# Altium project All-in-One.PrjPcb
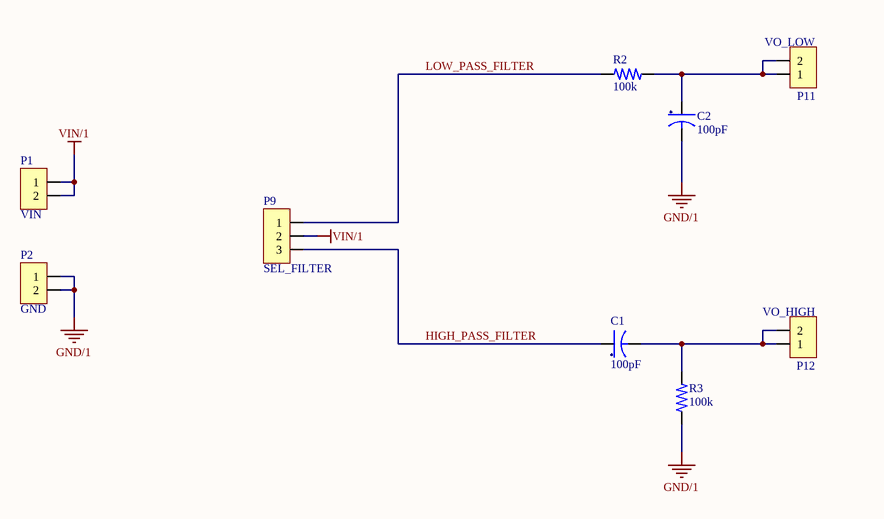
[diagram p0: Experiment 1.SchDoc]
3 sheets, 48 parts. Net scope: global (net labels, ports and power ports of the same name join across sheets).
Board file: All-in-One.PcbDoc
Sheets:
  Experiment 1.SchDoc
  Experiment 2.SchDoc
  Experiment 3.SchDoc

## Sheet Experiment 1.SchDoc
size A4; Organization: Altium Limited; Address1: L3, 12a Rodborough Rd; Address2: Frenchs Forest; Address3: NSW; Address4: Australia 2086; DocumentNumber: 1; SheetNumber: 1; SheetTotal: 3

### Parts
C1  100pF  [C0805]
C2  100pF  [C0805]
P1  VIN  [PINHD-1X02 ONCE]  (net tie, no BOM)
P2  GND  [PINHD-1X02 ONCE]  (net tie, no BOM)
P9  SEL_FILTER  [PINHD-1X03]
P11  VO_LOW  [PINHD-1X02 ONCE]  (net tie, no BOM)
P12  VO_HIGH  [PINHD-1X02 ONCE]  (net tie, no BOM)
R2  100k  [R0805]
R3  100k  [R0805]

### Nets
GND/1: C2.2 P2.1 P2.2 R3.1
VIN/1: P1.1 P1.2 P9.2
HIGH_PASS_FILTER: C1.1 P9.3
LOW_PASS_FILTER: P9.1 R2.1
NetC1_2: C1.2 P12.1 P12.2 R3.2
NetC2_1: C2.1 P11.1 P11.2 R2.2

### Notes on the sheet
- Elivelton Santos
- https://github.com/eliveltonpsantos
- Project:
- Sheet:
- Date:
- Time:
- Sheet
- of
- File:

### Library data of the parts
C1 C2 = CC0805JRNPO9BN101: CAP CER 100PF 50V NPO 0805; Manufacturer: Yageo; Tolerance: ±5%; Category: Capacitors; Manufacturer Part Number: CC0805JRNPO9BN101; Package / Case: 0805 (2012 Metric); Capacitance: 100pF; Voltage: 50V; Supplier 1: Digi-Key; Supplier Part Number 1: 311-1111-1-ND
P1 P2 P11 P12 = PIN HEADER 1X02 ONCE: CONN HEADER 2POS .100" STR TIN; Manufacturer: Molex, LLC; Manufacturer Part Number: 0901200122; Category: Connectors; Supplier 1: Digi-Key; Supplier Part Number 1: WM8072-ND
P9 = PIN HEADER 1X03: CONN HEADER 3POS .100" STR TIN; Manufacturer: Molex, LLC; Manufacturer Part Number: 0901200123; Category: Connectors; Supplier 1: Digi-Key; Supplier Part Number 1: WM8073-ND
R2 R3 = ERJ-6ENF1003V: RES SMD 100K OHM 1% 1/8W 0805; Manufacturer: Panasonic Electronic Components; Power (Watts): 0.125W, 1/8W; Category: Resistors; Manufacturer Part Number: ERJ-6ENF1003V; Package / Case: 0805 (2012 Metric); Resistance (Ohms): 100k; Tolerance: ±1%; Supplier 1: Digi-Key; Supplier Part Number 1: P100KCCT-ND

## Sheet Experiment 2.SchDoc
size A4; Organization: Altium Limited; Address1: L3, 12a Rodborough Rd; Address2: Frenchs Forest; Address3: NSW; Address4: Australia 2086; DocumentNumber: 2; SheetNumber: 2; SheetTotal: 3
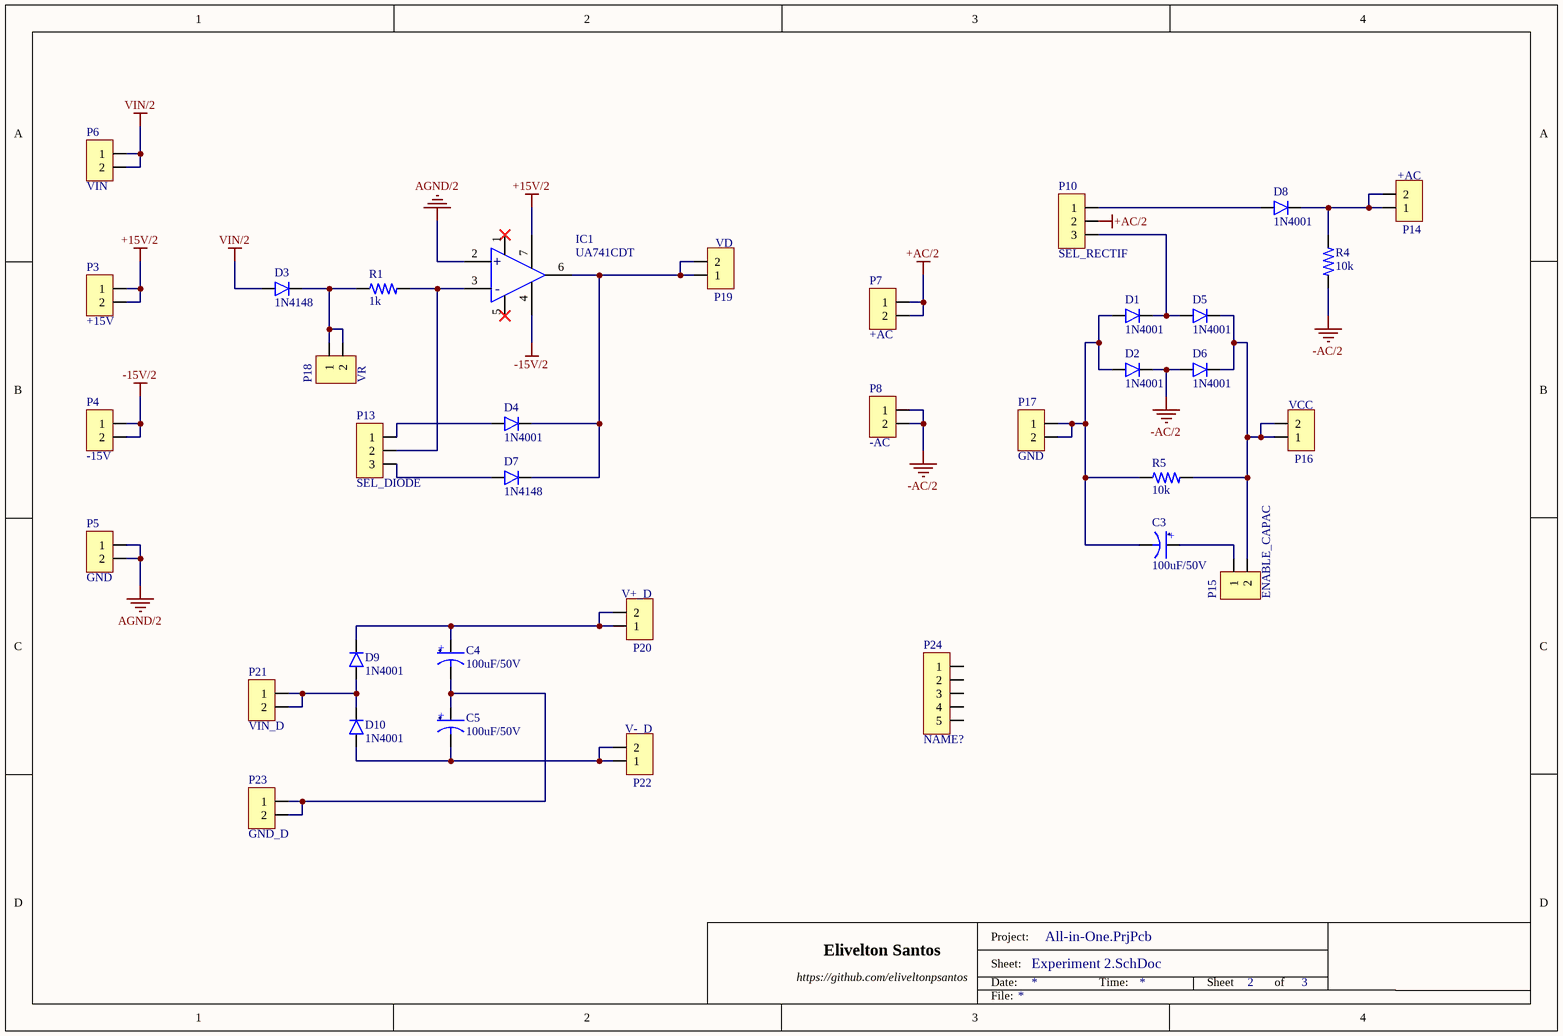
[diagram p1: Experiment 2.SchDoc]

### Parts
C3  100uF/50V  [C-3.5x8]
C4  100uF/50V  [C-3.5x8]
C5  100uF/50V  [C-3.5x8]
D1  1N4001  [DO41-10]
D2  1N4001  [DO41-10]
D3  1N4148  [DO35-10]
D4  1N4001  [DO41-10]
D5  1N4001  [DO41-10]
D6  1N4001  [DO41-10]
D7  1N4148  [DO35-10]
D8  1N4001  [DO41-10]
D9  1N4001  [DO41-10]
D10  1N4001  [DO41-10]
IC1  UA741CDT  [SOIC-8]
P3  +15V  [PINHD-1X02 ONCE]  (net tie, no BOM)
P4  -15V  [PINHD-1X02 ONCE]  (net tie, no BOM)
P5  GND  [PINHD-1X02 ONCE]  (net tie, no BOM)
P6  VIN  [PINHD-1X02 ONCE]  (net tie, no BOM)
P7  +AC  [PINHD-1X02 ONCE]  (net tie, no BOM)
P8  -AC  [PINHD-1X02 ONCE]  (net tie, no BOM)
P10  SEL_RECTIF  [PINHD-1X03]
P13  SEL_DIODE  [PINHD-1X03]
P14  +AC  [PINHD-1X02 ONCE]  (net tie, no BOM)
P15  ENABLE_CAPAC  [PINHD-1X02]
P16  VCC  [PINHD-1X02 ONCE]  (net tie, no BOM)
P17  GND  [PINHD-1X02 ONCE]  (net tie, no BOM)
P18  VR  [PINHD-1X02 ONCE]  (net tie, no BOM)
P19  VD  [PINHD-1X02 ONCE]  (net tie, no BOM)
P20  V+_D  [PINHD-1X02 ONCE]
P21  VIN_D  [PINHD-1X02 ONCE]
P22  V-_D  [PINHD-1X02 ONCE]
P23  GND_D  [PINHD-1X02 ONCE]
P24  NAME?  [PINHD-1X05]
R1  1k  [R0805]
R4  10k  [R0805]
R5  10k  [R0805]

### Nets
+15V/2: IC1.7(VCC+) P3.1 P3.2
+AC/2: P7.1 P7.2 P10.2
-15V/2: IC1.4(VCC-) P4.1 P4.2
-AC/2: D2.C(Cathode) D6.A(Anode) P8.1 P8.2 R4.1
AGND/2: IC1.2(-) P5.1 P5.2
VIN/2: D3.A(Anode) P6.1 P6.2
NetC3_1: C3.1(+) P15.1
NetC3_2: C3.2(-) D1.A(Anode) D2.A(Anode) P17.1 P17.2 R5.1
NetC4_1: C4.1(+) D9.C(Cathode) P20.1 P20.2
NetC4_2: C4.2(-) C5.1(+) P23.1 P23.2
NetC5_2: C5.2(-) D10.A(Anode) P22.1 P22.2
NetD1_C: D1.C(Cathode) D5.A(Anode) P10.3
NetD3_C: D3.C(Cathode) P18.1 P18.2 R1.1
NetD4_A: D4.A(Anode) P13.1
NetD4_C: D4.C(Cathode) D7.C(Cathode) IC1.6(OUTPUT) P19.1 P19.2
NetD5_C: D5.C(Cathode) D6.C(Cathode) P15.2 P16.1 P16.2 R5.2
NetD7_A: D7.A(Anode) P13.3
NetD8_A: D8.A(Anode) P10.1
NetD8_C: D8.C(Cathode) P14.1 P14.2 R4.2
NetD9_A: D9.A(Anode) D10.C(Cathode) P21.1 P21.2
NetIC1_3: IC1.3(+) P13.2 R1.2

Not connected (* = marked no-connect by the designer): IC1 1(OFFSET1)* 5(OFFSET2)*; P24 1 2 3 4 5

### Notes on the sheet
- Elivelton Santos
- https://github.com/eliveltonpsantos
- Project:
- Sheet:
- Date:
- Time:
- Sheet
- of
- File:

### Library data of the parts
C3-C5 = UVR1H101MPD: CAP ALUM 100UF 20% 50V RADIAL; Manufacturer: Nichicon; Category: Capacitors; Manufacturer Part Number: UVR1H101MPD; Package / Case: C-3.5x8; Capacitance: 100uF; Tolerance: ±20%; Supplier 1: Digi-Key; Supplier Part Number 1: 493-1107-ND; Voltage: 50V
D1 D2 D4-D6 D8-D10 = 1N4001: DIODE GEN PURP 50V 1A DO41; Manufacturer: Fairchild Semiconductor; Category: Diodes; Manufacturer Part Number: 1N4001; Package / Case: DO-41; Reverse Voltage: 50V; Forward Current: 1A; Supplier 1: Digi-Key; Supplier Part Number 1: 1N4001FSCT-ND
D3 D7 = 1N4148: DIODE GEN PURP 100V 200MA DO35; Manufacturer: Fairchild Semiconductor; Category: Diodes; Manufacturer Part Number: 1N4148; Package / Case: DO-35; Reverse Voltage: 100V; Forward Current: 200mA; Supplier 1: Digi-Key; Supplier Part Number 1: 1N4148FS-ND
IC1 = UA741CDT: IC OPAMP GP 1MHZ 8SO; Manufacturer: STMicroelectronics; Category: ICs; Manufacturer Part Number: UA741CDT; Package / Case: 8-SOIC; Supplier 1: Digi-Key; Supplier Part Number 1: 497-3075-1-ND
P3-P8 P14 P16-P23 = PIN HEADER 1X02 ONCE: as P1 on sheet Experiment 1; Category: Connectors; Supplier 1: Digi-Key; Supplier Part Number 1: WM8072-ND
P10 P13 = PIN HEADER 1X03: as P9 on sheet Experiment 1; Category: Connectors; Supplier 1: Digi-Key; Supplier Part Number 1: WM8073-ND
P15 = PIN HEADER 1X02: CONN HEADER 2POS .100" STR TIN; Manufacturer: Molex, LLC; Manufacturer Part Number: 0901200122; Category: Connectors; Supplier 1: Digi-Key; Supplier Part Number 1: WM8072-ND
P24 = PIN HEADER 1X05: CONN HEADER 5POS .100" STR TIN; Manufacturer: Molex, LLC; Manufacturer Part Number: 0901200125; Category: Connectors; Supplier 1: Digi-Key; Supplier Part Number 1: WM8075-ND
R1 = ERJ-6ENF1001V: RES SMD 1K OHM 1% 1/8W 0805; Manufacturer: Panasonic Electronic Components; Power (Watts): 0.125W, 1/8W; Category: Resistors; Manufacturer Part Number: ERJ-6ENF1001V; Package / Case: 0805 (2012 Metric); Resistance (Ohms): 1k; Tolerance: ±1%; Supplier 1: Digi-Key; Supplier Part Number 1: P1.00KCCT-ND
R4 R5 = ERJ-6ENF1002V: RES SMD 10K OHM 1% 1/8W 0805; Manufacturer: Panasonic Electronic Components; Power (Watts): 0.125W, 1/8W; Category: Resistors; Manufacturer Part Number: ERJ-6ENF1002V; Package / Case: 0805 (2012 Metric); Resistance (Ohms): 10k; Tolerance: ±1%; Supplier 1: Digi-Key; Supplier Part Number 1: P10.0KCCT-ND

## Sheet Experiment 3.SchDoc
size A4; Organization: Altium Limited; Address1: L3, 12a Rodborough Rd; Address2: Frenchs Forest; Address3: NSW; Address4: Australia 2086; DocumentNumber: 3; SheetNumber: 3; SheetTotal: 3
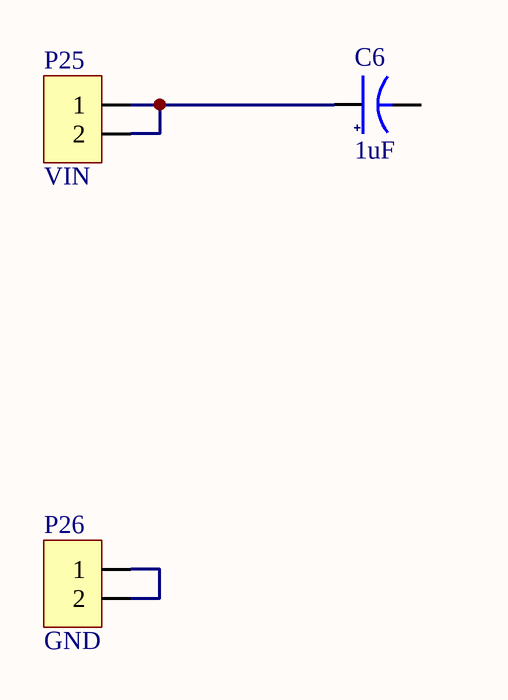
[diagram p2: Experiment 3.SchDoc]

### Parts
C6  1uF  [C0805]
P25  VIN  [PINHD-1X02 ONCE]
P26  GND  [PINHD-1X02 ONCE]

### Nets
NetC6_1: C6.1 P25.1 P25.2
NetP26_1: P26.1 P26.2

Not connected (* = marked no-connect by the designer): C6 2

### Notes on the sheet
- Elivelton Santos
- https://github.com/eliveltonpsantos
- Project:
- Sheet:
- Date:
- Time:
- Sheet
- of
- File:

### Library data of the parts
C6 = CC0805ZKY5V9BB105: CAP CER 1UF 50V Y5V 0805; Manufacturer: Yageo; Tolerance: ±20%; Category: Capacitors; Manufacturer Part Number: CC0805ZKY5V9BB105; Package / Case: 0805 (2012 Metric); Capacitance: 1uF; Voltage: 50V; Supplier 1: Digi-Key; Supplier Part Number 1: 311-1909-1-ND
P25 P26 = PIN HEADER 1X02 ONCE: as P1 on sheet Experiment 1; Category: Connectors; Supplier 1: Digi-Key; Supplier Part Number 1: WM8072-ND